# EAGLE schematic simplePDschematicsv3_AZ_SMD (EAGLE 6.6.0)
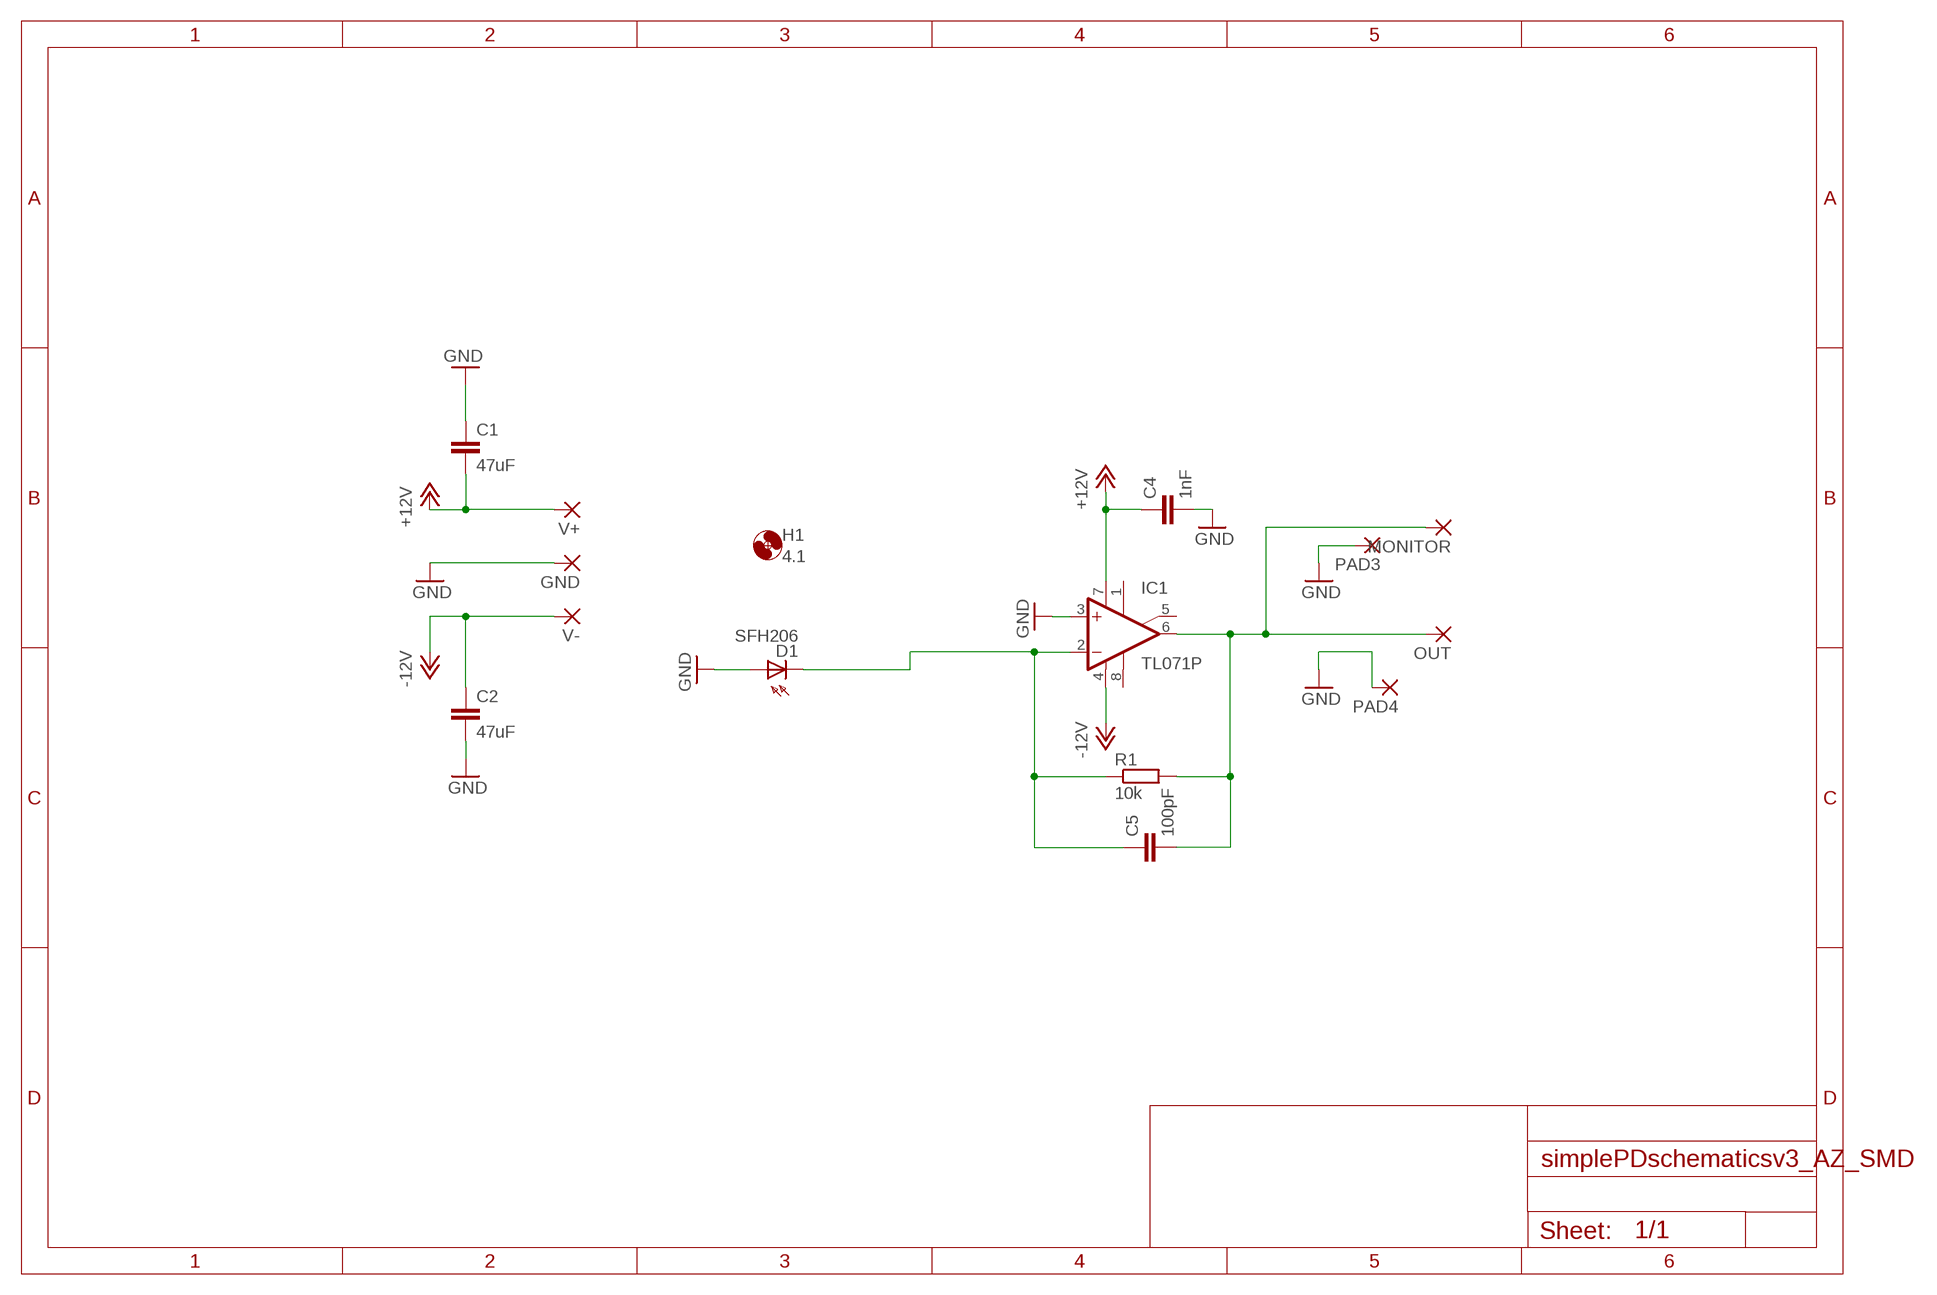
[diagram p0: schematic, sheet 1]

## Parts
C1  47uF  C-EU050-075X075  [C050-075X075]
C2  47uF  C-EU050-075X075  [C050-075X075]
C4  1nF  C-EU025-050X050  [C025-050X050]
C5  100pF  C-EU025-050X050  [C025-050X050]
D1  SFH206  [SFH206]
GND  1,6/0,9  [1,6/0,9]
H1  4.1  MOUNT-HOLE4.1  [4,1]
IC1  TL071P  [DIL08]
MONITOR  1,6/0,9  [1,6/0,9]
OUT  1,6/0,9  [1,6/0,9]
PAD3  1,6/0,9  [1,6/0,9]
PAD4  1,6/0,9  [1,6/0,9]
R1  10k  R-EU_M1206  [M1206]
V+  1,6/0,9  [1,6/0,9]
V-  1,6/0,9  [1,6/0,9]

## Nets
GND: C1.1 C2.2 C4.2 D1.A GND.1(P) IC1.3(+IN) PAD3.1(P) PAD4.1(P)
N$2: C5.2 IC1.6(OUT) MONITOR.1(P) OUT.1(P) R1.2
N$3: C5.1 D1.K(C) IC1.2(-IN) R1.1
V+: C1.2 C4.1 IC1.7(V+) V+.1(P) ; supply symbol labelled +12V
V-: C2.1 IC1.4(V-) V-.1(P) ; supply symbol labelled -12V
Unconnected: IC1.1(ON1) IC1.5(ON2) IC1.8(OPT)

## Library data of the parts
C1 C2 C4 C5 = resistor:C-EU: CAPACITOR, European symbol
D1 = opto-trans-siemens:SFH206: PHOTO DIODE; MPN: SFH206K; OC_FARNELL: 1212741; OC_NEWARK: 01M8807
GND MONITOR OUT PAD3 PAD4 V+ V- = wirepad:1,6/0,9: THROUGH-HOLE PAD
H1 = holes:MOUNT-HOLE: MOUNTING HOLE with drill center marker
IC1 = linear:TL071: OP AMP
R1 = resistor:R-EU_: RESISTOR, European symbol